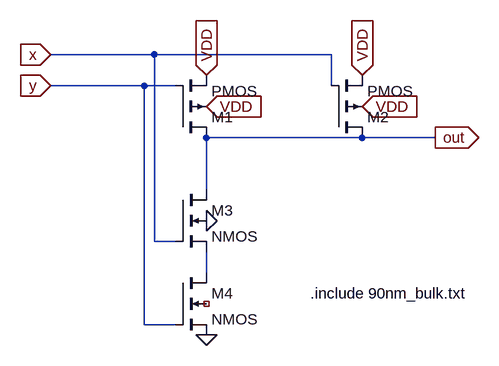
[diagram p0: schematic nand.asc]
nand.asc, the LTspice schematic file:
Version 4.1
SHEET 1 880 680
WIRE 96 32 -64 32
WIRE 368 32 96 32
WIRE 80 80 -64 80
WIRE 128 80 80 80
WIRE 368 80 368 32
WIRE 416 160 176 160
WIRE 528 160 416 160
WIRE 176 240 176 160
WIRE 96 320 96 32
WIRE 128 320 96 320
WIRE 176 368 176 336
WIRE 80 448 80 80
WIRE 128 448 80 448
FLAG 176 464 0
FLAG 176 288 0
FLAG -64 80 y
IOPIN -64 80 In
FLAG -64 32 x
IOPIN -64 32 In
FLAG 416 64 VDD
IOPIN 416 64 In
FLAG 416 112 VDD
IOPIN 416 112 In
FLAG 176 112 VDD
IOPIN 176 112 In
FLAG 176 64 VDD
IOPIN 176 64 In
FLAG 528 160 out
IOPIN 528 160 Out
SYMBOL pmos4 128 160 M180
SYMATTR InstName M1
SYMBOL pmos4 368 160 M180
SYMATTR InstName M2
SYMBOL nmos4 128 240 R0
SYMATTR InstName M3
SYMBOL nmos4 128 368 R0
SYMATTR InstName M4
TEXT 336 400 Left 2 !.include 90nm_bulk.txt

The netlist it stands for:
* nand.asc
M1 out y VDD VDD PMOS
M2 out x VDD VDD PMOS
M3 out x N001 0 NMOS
M4 N001 y 0 NC_01 NMOS
.model NMOS NMOS
.model PMOS PMOS
.lib standard.mos
.include 90nm_bulk.txt
.backanno
.end